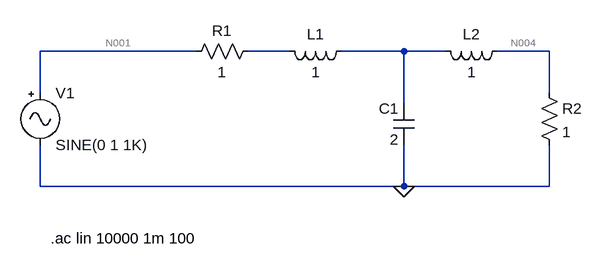
[diagram p0: schematic Ej1.asc]
Ej1.asc, the LTspice schematic file:
Version 4
SHEET 1 1092 680
WIRE 320 256 80 256
WIRE 464 256 400 256
WIRE 640 256 544 256
WIRE 704 256 640 256
WIRE 864 256 784 256
WIRE 80 320 80 256
WIRE 864 320 864 256
WIRE 640 336 640 256
WIRE 80 464 80 400
WIRE 640 464 640 400
WIRE 640 464 80 464
WIRE 864 464 864 400
WIRE 864 464 640 464
FLAG 640 464 0
SYMBOL Misc/signal 80 304 R0
SYMATTR InstName V1
SYMATTR Value2 AC 1
SYMBOL Res 416 240 R90
WINDOW 0 0 56 VBottom 2
WINDOW 3 32 56 VTop 2
SYMATTR InstName R1
SYMATTR Value 1
SYMBOL Ind 560 240 R90
WINDOW 0 5 56 VBottom 2
WINDOW 3 32 56 VTop 2
SYMATTR InstName L1
SYMATTR Value 1
SYMBOL Ind 800 240 R90
WINDOW 0 5 56 VBottom 2
WINDOW 3 32 56 VTop 2
SYMATTR InstName L2
SYMATTR Value 1
SYMBOL Cap 656 400 R180
WINDOW 0 24 56 Left 2
WINDOW 3 24 8 Left 2
SYMATTR InstName C1
SYMATTR Value 2
SYMBOL Res 848 304 R0
SYMATTR InstName R2
SYMATTR Value 1
TEXT 96 544 Left 2 !.ac lin 10000 1m 100

The netlist it stands for:
* Ej1.asc
V1 N001 0 SINE(0 1 1K) AC 1
R1 N002 N001 1
L1 N003 N002 1
L2 N004 N003 1
C1 0 N003 2
R2 N004 0 1
.ac lin 10000 1m 100
.backanno
.end

* Results of the author's LTspice run, read from the files saved beside the schematic
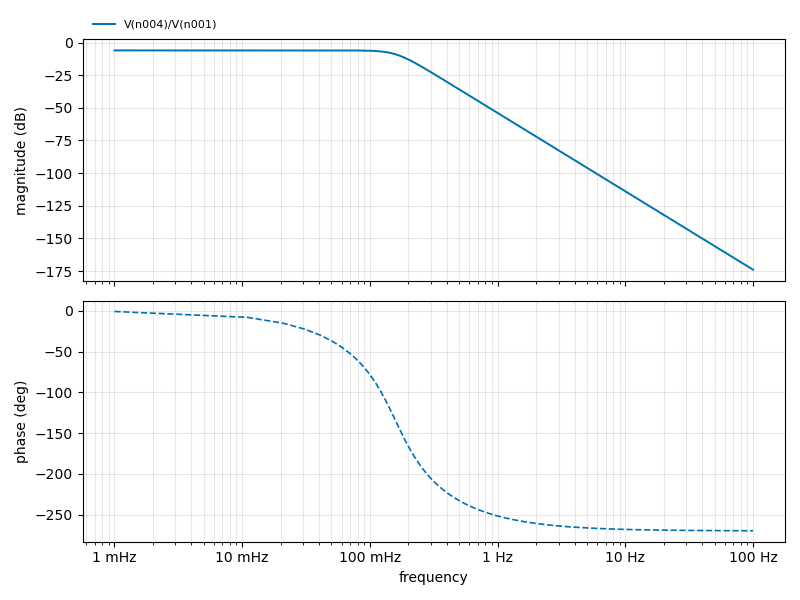
[diagram p1: AC Analysis of Ej1.asc, plotted from the saved traces]
* AC Analysis, 1 run:
*   V(n004)/V(n001): -6.03 dB at 1 mHz, -173.91 dB at 100 Hz, peak -6.03 dB at 1 mHz, 3 dB below the peak at 158.9 mHz